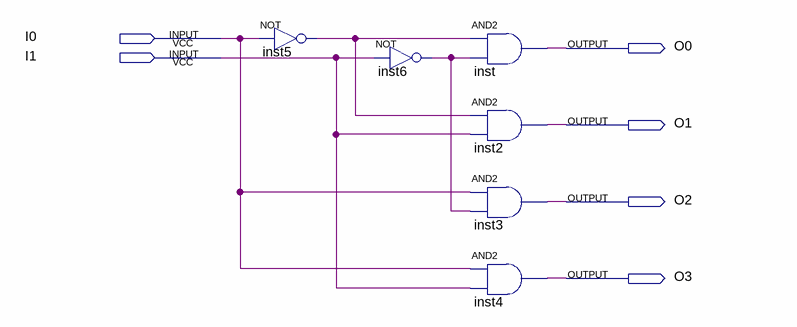
[diagram p0: schematic sheet]
// Quartus schematic 2TO4DCDR.bdf as structural Verilog: 6 symbols, 6 pins
module \2TO4DCDR  (
  input  I0,
  input  I1,
  output O0,
  output O1,
  output O2,
  output O3
);

  wire inst5_out, inst6_out;

  not inst5 (inst5_out, I0);
  not inst6 (inst6_out, I1);
  and inst (O0, inst5_out, inst6_out);
  and inst2 (O1, inst5_out, I1);
  and inst3 (O2, I0, inst6_out);
  and inst4 (O3, I0, I1);
endmodule
